# EAGLE design DoorBellBothRelayBJT (EAGLE 7.7.0)
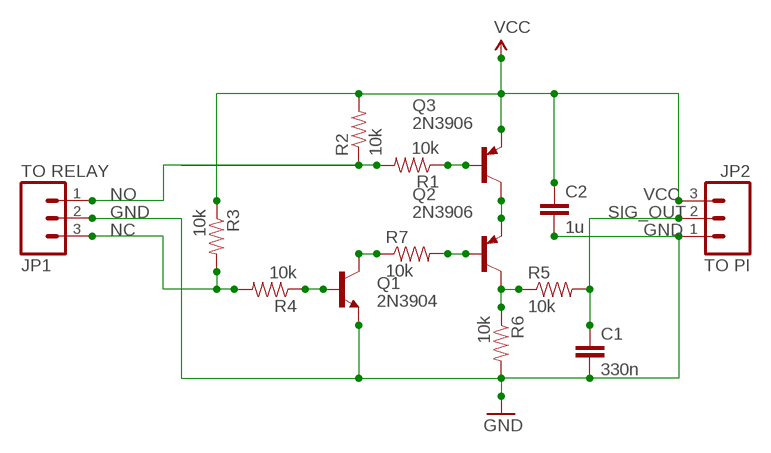
[diagram p0: schematic, sheet 1]

## Parts
C1  330n  CAPKIT  [CAP-PTH-SMALL-KIT]
C2  1u  CAPKIT  [CAP-PTH-SMALL-KIT]
JP1  TO RELAY  M031X03_NO_SILK  [1X03_NO_SILK]
JP2  TO PI  M031X03_NO_SILK  [1X03_NO_SILK]
Q1  2N3904  TRANSISTOR_NPN2N3904  [TO-92]
Q2  2N3906  [TO92]
Q3  2N3906  [TO92]
R1  10k  RESISTOREZ  [AXIAL-0.3EZ]
R2  10k  RESISTOREZ  [AXIAL-0.3EZ]
R3  10k  RESISTOREZ  [AXIAL-0.3EZ]
R4  10k  RESISTOREZ  [AXIAL-0.3EZ]
R5  10k  RESISTOREZ  [AXIAL-0.3EZ]
R6  10k  RESISTOREZ  [AXIAL-0.3EZ]
R7  10k  RESISTOREZ  [AXIAL-0.3EZ]

## Nets
GND: C1.2 C2.2 JP1.2 JP2.1 Q1.1(E) R6.P$2
N$1: Q1.3(C) R7.P$1
N$2: Q2.2(B) R7.P$2
N$4: Q1.2(B) R4.P$1
N$5: Q3.2(B) R1.P$1
N$14: Q2.3(E) Q3.1(C)
N$23: Q2.1(C) R5.P$1 R6.P$1
NC: JP1.3 R3.P$2 R4.P$2
NO: JP1.1 R1.P$2 R2.P$1
SIG_OUT: C1.1 JP2.2 R5.P$2
VCC: C2.1 JP2.3 Q3.3(E) R2.P$2 R3.P$1

## Library data of the parts
C1 C2 = SparkFun-Capacitors:CAP: Capacitor Standard 0603 ceramic capacitor, and 0.1" leaded capacitor.
JP1 JP2 = SparkFun-Connectors:M03: Header 3 Standard 3-pin 0.1" header. Use with straight break away headers (SKU : PRT-00116), right angle break away headers (PRT-00553), swiss pins (PRT-00743), machine pins (PRT-00117), and female headers (PRT-00115). Molex polarized connector foot print use with SKU : PRT-08232 with associated crimp pins and housings.
Q1 = SparkFun-DiscreteSemi:TRANSISTOR_NPN: Generic NPN BJT MMBT2222A - TRANS-08049 (SOT-23, 1A 40V) MPSA42 - TRANS-09116 (SOT-23, 500mA 300V) MMBT5088LT1G - TRANS-11160 (SOT-23, 50 mA 30V) BC547 - COM-08928 <http://www.sparkfun.com/products/8928> (TO-92 45V 100mA) (1.Collector 2.Base 3.Emitter) 2N3904 - COM-00521 <http://www.sparkfun.com/products/521> (TO-92 40V 200mA) (1.Emitter 2.Base 3.Collector) P2N2222A - COM-12852 <http://www.sparkfun.com/products/12852> (TO-92 40V 600mA) (1.Collector 2.Base 3.Emitter); PROD_ID: TRANS-08447
Q2 Q3 = transistor-pnp:2N3906: PNP Transistor
R1-R7 = SparkFun-Passives:RESISTOR: Resistor Basic schematic elements and footprints for 0603, 1206, and PTH resistors.

## Board
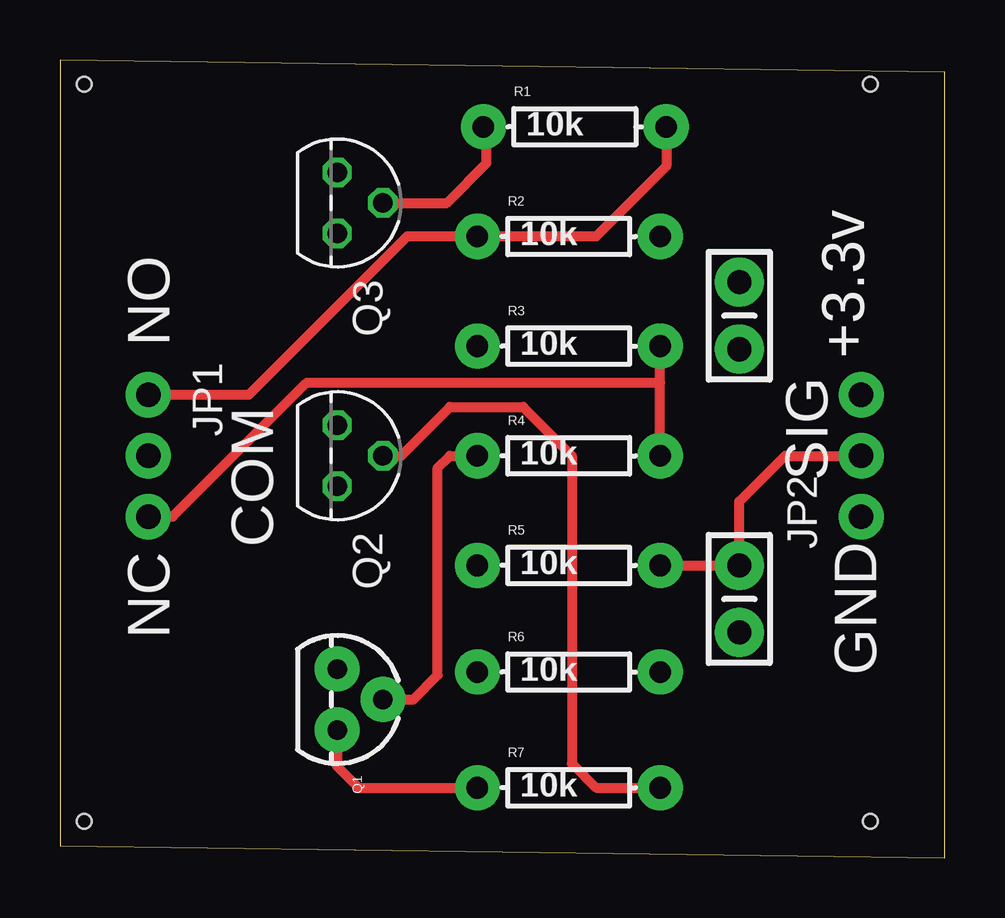
[diagram p1: board, top side]
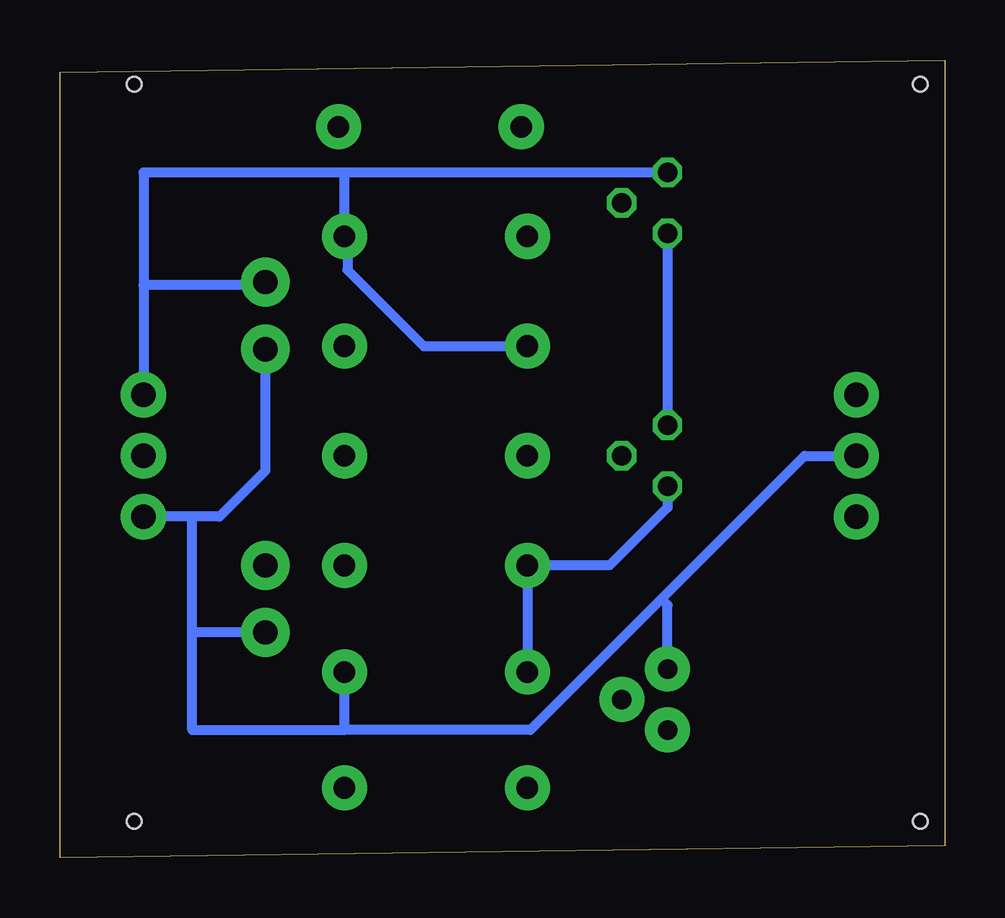
[diagram p2: board, bottom side, seen from below]

Size 36.88 x 33.26 mm. Coordinates in mm from the lower left corner, seen from the top.
Outline: 0,0.51 36.88,0 36.88,32.76 0,33.26 0,0.51
Copper layers (1*16): Top 0.018mm / dielectric 1.55mm / Bottom 0.018mm
Design rules "eC_2Layer_PClass6_BaseCopperO18_eCDefault": minimum track width 0.15mm, minimum drill 0.35mm, track to track 0.15mm, track to pad 0.15mm, pad to pad 0.15mm, via to via 0.15mm, smd to smd 0mil, copper to edge 0.25mm, drill to drill 0.35mm, minimum pad ring 0.175mm, minimum via ring 0.125mm, stop-mask expansion 0mil, vias tented up to drill 0.45mm, thermal gap 0.2mm
Holes 0.6 mm at 1.02,32.26 33.78,32.26 1.02,1.52 33.78,1.52

### Footprints (pad centres in the part's own frame; a part is rotated, then mirrored left to right if it is on the bottom)
CAP-PTH-SMALL-KIT = drill 1.016 pad 2.032: 1 -1.397,0; 2 1.397,0
1X03_NO_SILK = drill 1.016 pad 1.88: 1 0,0; 2 2.54,0; 3 5.08,0
TO-92 = drill 0.813 pad 1.88: 1 -1.27,0; 2 0,1.905; 3 1.27,0
TO92 = drill 0.813 octagon: 1 1.27,0; 2 0,1.905; 3 -1.27,0
AXIAL-0.3EZ = drill 0.9 pad 1.88: P$1 -3.81,0; P$2 3.81,0

### Placement (x,y rotation side)
C1  28.32,10.8 270 top
C2  28.32,22.61 270 top
JP1  3.68,19.3 270 top
JP2  33.4,14.22 90 top
Q1  11.56,6.6 270 top
Q2  11.56,16.76 270 top
Q3  11.56,27.3 270 top
R1  21.46,30.48 0 top
R2  21.21,25.91 0 top
R3  21.21,21.34 0 top
R4  21.21,16.76 0 top
R5  21.21,12.19 0 top
R6  21.21,7.75 0 top
R7  21.21,2.92 0 top

### Tracks (layer width: path | path; a pad name or v marks a point on that pad's centre or on a via)
GND
  Bottom 0.406: 25.02,5.33 17.27,5.33 11.81,10.8 | 25.02,5.33 R6.P$2 | 25.02,5.33 31.37,5.33 31.37,9.4 | C1.2 31.37,9.4 | 31.37,9.4 31.37,14.22 JP2.1 30.23,14.22 28.32,16.13 C2.2 | JP1.2 5.84,16.76 11.81,10.8 | Q1.1 11.56,10.54 11.81,10.8
N$1
  Top 0.406: Q1.3 11.56,3.81 12.45,2.92 R7.P$1
N$2
  Top 0.406: Q2.2 14.22,16.76 16.26,18.8 19.3,18.8 21.34,16.76 21.34,3.94 22.35,2.92 R7.P$2
N$4
  Top 0.406: Q1.2 14.73,6.6 15.75,7.62 15.75,16.26 16.26,16.76 R4.P$1
N$5
  Top 0.406: Q3.2 16.13,27.3 17.78,28.96 17.78,30.35 R1.P$1
N$14
  Bottom 0.406: Q3.1 Q2.3
N$23
  Bottom 0.406: R6.P$1 R5.P$1 13.97,12.19 11.56,14.61 Q2.1
NC
  Top 0.406: R4.P$2 25.02,19.81 | 25.02,19.81 R3.P$2 | JP1.3 4.7,14.22 10.29,19.81 25.02,19.81
NO
  Top 0.406: R1.P$2 25.27,28.83 22.35,25.91 R2.P$1 14.48,25.91 7.87,19.3 JP1.1
SIG_OUT
  Top 0.406: R5.P$2 C1.1 28.32,14.86 30.23,16.76 JP2.2
VCC
  Bottom 0.406: Q3.3 25.02,28.57 | 25.02,28.57 33.4,28.57 33.4,23.88 | 33.4,23.88 JP2.3 | 25.02,28.57 R2.P$2 24.89,25.78 24.89,24.51 21.72,21.34 R3.P$1 | C2.1 28.32,23.88 33.4,23.88

### Text on the board
tPlace: NO | NC
tNames: +3.3v | COM | SIG | GND